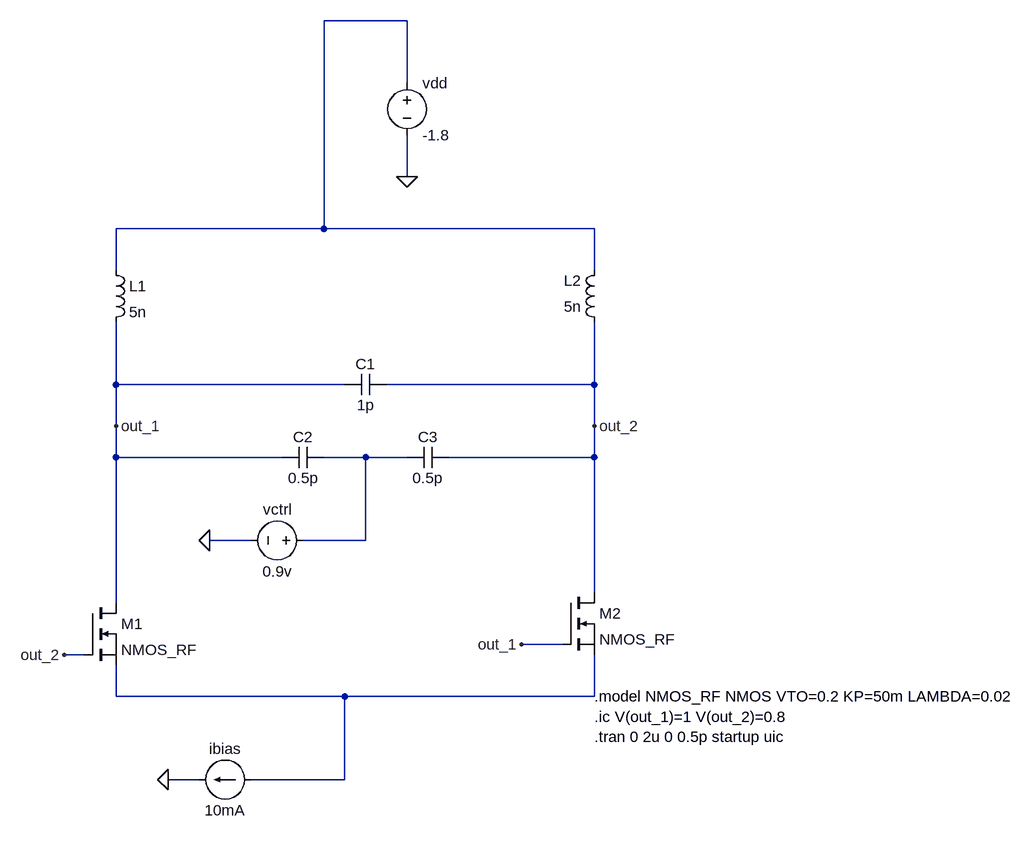
[diagram p0: schematic vco.asc]
vco.asc, the LTspice schematic file:
Version 4.1
SHEET 1 1348 1348
WIRE 256 -112 128 -112
WIRE 256 -16 256 -112
WIRE 256 128 256 64
WIRE 128 208 128 -112
WIRE 128 208 -192 208
WIRE 544 208 128 208
WIRE -192 272 -192 208
WIRE 544 272 544 208
WIRE -192 448 -192 352
WIRE 160 448 -192 448
WIRE 544 448 544 352
WIRE 544 448 224 448
WIRE -192 512 -192 448
WIRE 544 512 544 448
WIRE -192 560 -192 512
WIRE 64 560 -192 560
WIRE 192 560 128 560
WIRE 256 560 192 560
WIRE 544 560 544 512
WIRE 544 560 320 560
WIRE 16 688 -48 688
WIRE 192 688 192 560
WIRE 192 688 96 688
WIRE 544 768 544 560
WIRE -192 784 -192 560
WIRE 496 848 432 848
WIRE -240 864 -272 864
WIRE -192 928 -192 880
WIRE 160 928 -192 928
WIRE 544 928 544 864
WIRE 544 928 160 928
WIRE -64 1056 -112 1056
WIRE 160 1056 160 928
WIRE 160 1056 16 1056
FLAG -192 512 out_1
FLAG 544 512 out_2
FLAG 432 848 out_1
FLAG -112 1056 0
FLAG -272 864 out_2
FLAG 256 128 0
FLAG -48 688 0
SYMBOL voltage 256 -32 R0
SYMATTR InstName vdd
SYMATTR Value -1.8
SYMBOL ind -208 256 R0
SYMATTR InstName L1
SYMATTR Value 5n
SYMATTR SpiceLine Rser=0
SYMBOL ind 560 368 R180
WINDOW 0 36 80 Left 2
WINDOW 3 36 40 Left 2
SYMATTR InstName L2
SYMATTR Value 5n
SYMATTR SpiceLine Rser=0
SYMBOL cap 224 432 R90
WINDOW 0 0 32 VBottom 2
WINDOW 3 32 32 VTop 2
SYMATTR InstName C1
SYMATTR Value 1p
SYMBOL cap 128 544 R90
WINDOW 0 0 32 VBottom 2
WINDOW 3 32 32 VTop 2
SYMATTR InstName C2
SYMATTR Value 0.5p
SYMBOL cap 320 544 R90
WINDOW 0 0 32 VBottom 2
WINDOW 3 32 32 VTop 2
SYMATTR InstName C3
SYMATTR Value 0.5p
SYMBOL voltage 112 688 R90
WINDOW 0 -32 56 VBottom 2
WINDOW 3 32 56 VTop 2
SYMATTR InstName vctrl
SYMATTR Value 0.9v
SYMBOL nmos -240 784 R0
SYMATTR InstName M1
SYMATTR Value NMOS_RF
SYMBOL nmos 496 768 R0
SYMATTR InstName M2
SYMATTR Value NMOS_RF
SYMBOL current 16 1056 R90
WINDOW 0 -32 40 VBottom 2
WINDOW 3 32 40 VTop 2
WINDOW 123 0 0 Left 0
WINDOW 39 0 0 Left 0
SYMATTR InstName ibias
SYMATTR Value 10mA
TEXT 544 928 Left 2 !.model NMOS_RF NMOS VTO=0.2 KP=50m LAMBDA=0.02\n.ic V(out_1)=1 V(out_2)=0.8\n.tran 0 2u 0 0.5p startup uic

The netlist it stands for:
* vco.asc
vdd N001 0 -1.8
L1 N001 out_1 5n Rser=0
L2 out_2 N001 5n Rser=0
C1 out_2 out_1 1p
C2 N002 out_1 0.5p
C3 out_2 N002 0.5p
vctrl N002 0 0.9v
M1 out_1 out_2 N003 N003 NMOS_RF
M2 out_2 out_1 N003 N003 NMOS_RF
ibias N003 0 10mA
.model NMOS NMOS
.model PMOS PMOS
.lib standard.mos
.model NMOS_RF NMOS VTO=0.2 KP=50m LAMBDA=0.02
.ic V(out_1)=1 V(out_2)=0.8
.tran 0 2u 0 0.5p startup uic
.backanno
.end